# EAGLE design es9023 (EAGLE 6.1)
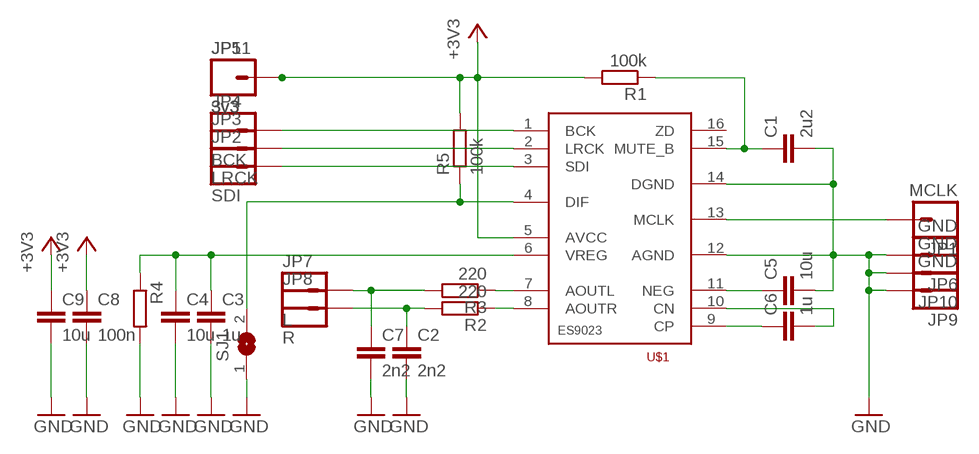
[diagram p0: schematic, sheet 1]

## Parts
C1  2u2  C-EUC0805K  [C0805K]
C2  2n2  C-EUC0805K  [C0805K]
C3  1u  C-EUC0805K  [C0805K]
C4  10u  C-EUC0805K  [C0805K]
C5  10u  C-EUC0805K  [C0805K]
C6  1u  C-EUC0805K  [C0805K]
C7  2n2  C-EUC0805K  [C0805K]
C8  100n  C-EUC0805K  [C0805K]
C9  10u  C-EUC0805K  [C0805K]
JP1  MCLK  M01PTH_LONGPAD  [1X01_LONGPAD]
JP2  SDI  M01PTH_LONGPAD  [1X01_LONGPAD]
JP3  LRCK  M01PTH_LONGPAD  [1X01_LONGPAD]
JP4  BCK  M01PTH_LONGPAD  [1X01_LONGPAD]
JP5  3v3  M01PTH_LONGPAD  [1X01_LONGPAD]
JP6  GND  M01PTH_LONGPAD  [1X01_LONGPAD]
JP7  L  M01PTH_LONGPAD  [1X01_LONGPAD]
JP8  R  M01PTH_LONGPAD  [1X01_LONGPAD]
JP9  GND  M01PTH_LONGPAD  [1X01_LONGPAD]
JP10  GND  M01PTH_LONGPAD  [1X01_LONGPAD]
JP11  3v3  M01PTH_LONGPAD  [1X01_LONGPAD]
R1  100k  R-EU_M0805  [M0805]
R2  220  R-EU_M0805  [M0805]
R3  220  R-EU_M0805  [M0805]
R4  R-EU_M0805  [M0805]
R5  100k  R-EU_M0805  [M0805]
SJ1  SJ  [SJ]
U$1  ES9023-SMD  [SOP16]

## Nets
+3V3: C8.1 C9.1 JP5.1 JP11.1 R1.2 R5.2 U$1.5(AVCC)
GND: C1.2 C2.2 C3.2 C4.2 C5.2 C7.2 C8.2 C9.2 JP6.1 JP9.1 JP10.1 R4.2 SJ1.1 U$1.12(AGND) U$1.14(DGND)
N$1: C1.1 R1.1 U$1.15(MUTE_B)
N$2: C3.1 C4.1 R4.1 U$1.6(VREG)
N$3: C5.1 U$1.11(NEG)
N$4: C6.2 U$1.10(CN)
N$5: C6.1 U$1.9(CP)
N$6: R3.1 U$1.7(AOUTL)
N$7: R2.1 U$1.8(AOUTR)
N$8: JP4.1 U$1.1(BCK)
N$9: JP3.1 U$1.2(LRCK)
N$10: JP2.1 U$1.3(SDI)
N$11: C7.1 JP7.1 R3.2
N$12: C2.1 JP8.1 R2.2
N$13: JP1.1 U$1.13(MCLK)
N$14: R5.1 SJ1.2 U$1.4(DIF)
Unconnected: U$1.16(ZD)

## Library data of the parts
C1-C9 = rcl:C-EU: CAPACITOR, European symbol
JP1-JP11 = _MY_OWN_LIB:M01: Header 1 Standard 1-pin 0.1" header. Use with straight break away headers (SKU : PRT-00116), right angle break away headers (PRT-00553), swiss pins (PRT-00743), machine pins (PRT-00117), and female headers (PRT-00115).
R1-R5 = rcl:R-EU_: RESISTOR, European symbol
SJ1 = jumper:SJ: SMD solder JUMPER
U$1 = _MY_OWN_LIB:ES9023

## Board
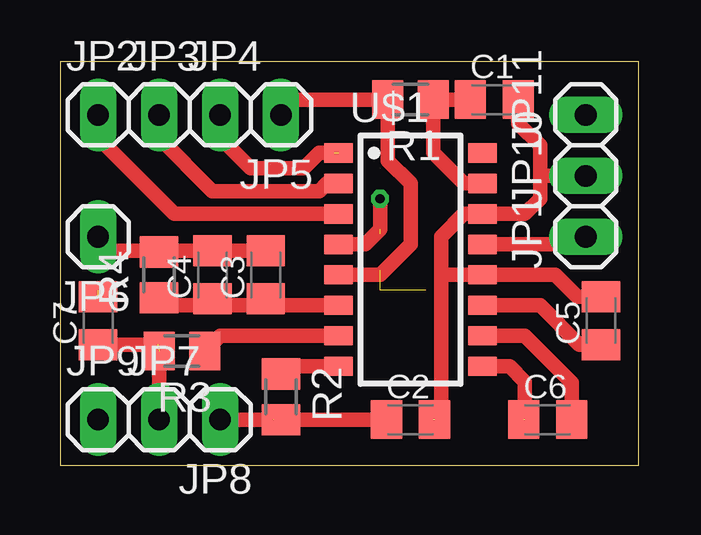
[diagram p1: board, top side]
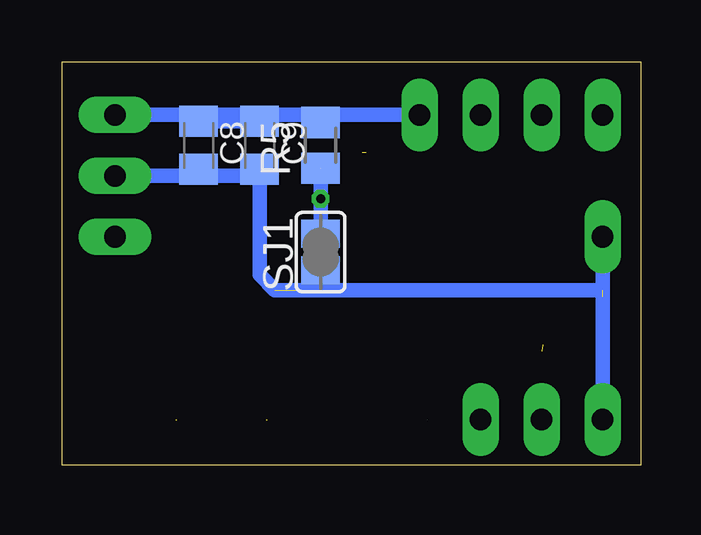
[diagram p2: board, bottom side, seen from below]

Size 24.11 x 16.82 mm. Coordinates in mm from the lower left corner, seen from the top.
Outline: 0,0 24.11,0 24.11,16.82 0,16.82 0,0
Copper layers (1*16): Top 0.0356mm / dielectric 1.5011mm / Bottom 0.0356mm
Design rules: minimum track width 6mil, minimum drill 13mil, track to track 6mil, track to pad 6mil, pad to pad 6mil, via to via 6mil, smd to smd 6mil, copper to edge 15mil, drill to drill 6mil, minimum pad ring 7mil, minimum via ring 7mil, stop-mask expansion 3mil, vias tented up to drill 0mil, thermal gap 10mil

### Footprints (pad centres in the part's own frame; a part is rotated, then mirrored left to right if it is on the bottom)
C0805K = smd 1.3 x 1.6: 1 -1,0; 2 1,0
1X01_LONGPAD = drill 0.9 pad 1.524 long: 1 0,0
M0805 = smd 1.3 x 1.6: 1 -0.95,0; 2 0.95,0
SJ = smd 1.168 x 1.6: 1 -0.762,0; 2 0.762,0
SOP16 = smd 0.8 x 1.2: 1 -4.445,-3; 2 -3.175,-3; 3 -1.905,-3; 4 -0.635,-3; 5 0.635,-3; 6 1.905,-3; 7 3.175,-3; 8 4.445,-3; 9 4.445,3; 10 3.175,3; 11 1.905,3; 12 0.635,3; 13 -0.635,3; 14 -1.905,3; 15 -3.175,3; 16 -4.445,3

### Placement (x,y rotation side)
C1  18.1,15.24 0 top
C2  14.61,1.91 0 top
C3  8.57,7.94 90 top
C4  6.35,7.94 90 top
C5  22.54,6.03 90 top
C6  20.32,1.91 0 top
C7  1.59,6.03 90 top
C8  18.41,13.34 270 bottom
C9  15.88,13.34 270 bottom
JP1  21.91,9.53 90 top
JP2  1.59,14.61 0 top
JP3  4.13,14.61 0 top
JP4  6.67,14.61 0 top
JP5  9.21,14.61 180 top
JP6  1.59,9.53 180 top
JP7  4.13,1.91 0 top
JP8  6.67,1.91 180 top
JP9  1.59,1.91 0 top
JP10  21.91,12.06 90 top
JP11  21.91,14.61 90 top
R1  14.61,15.24 180 top
R2  9.21,2.86 270 top
R3  5.08,4.76 180 top
R4  4.13,7.94 90 top
R5  13.34,13.34 90 bottom
SJ1  13.34,8.89 90 bottom
U$1  14.61,8.57 270 top

### Tracks (layer width: path | path; a pad name or v marks a point on that pad's centre or on a via)
+3V3
  Top 0.61: U$1.5 13.34,7.94 14.61,9.21 14.61,11.75 13.65,12.7 R1.2 9.84,15.24 JP5.1
  Bottom 0.61: JP11.1 15.88,14.61 | 15.88,14.61 13.34,14.61 | 13.34,14.61 JP5.1 | 15.88,14.61 C9.1 C8.1 | R5.2 13.34,14.61
GND  (5 unrouted)
  Top 0.61: C5.2 21.54,7.03 20.64,7.94 U$1.12 15.88,7.94 | 15.56,1.95 C2.2 | 20,12.06 20,11.11 19.37,10.48 U$1.14 16.83,10.48 15.88,9.53 15.88,7.94 | 20,12.06 20,13.34 19.1,14.24 C1.2 | JP10.1 20,12.06 | 15.88,7.94 15.88,2.22 15.56,1.91 | C3.2 C4.2 4.13,8.94 | 4.13,8.94 R4.2 | 4.13,8.94 2.17,8.94 JP6.1
  Bottom 0.61: JP9.1 1.59,7.3 | 1.59,7.3 JP6.1 | JP10.1 18.41,12.06 | 18.41,12.06 15.88,12.06 | 15.88,12.06 15.88,7.94 15.24,7.3 1.59,7.3 | C8.2 18.41,12.06 | C9.2 15.88,12.06
N$1
  Top 0.61: C1.1 R1.1 15.56,13.02 16.83,11.75 U$1.15
N$2
  Top 0.61: U$1.6 8.89,6.68 | 8.89,6.68 4.13,6.68 R4.1 4.13,6.67 6.35,6.67 C4.1 | C3.1 8.89,6.94 8.89,6.68
N$3
  Top 0.61: C5.1 21.64,5.03 20,6.67 U$1.11
N$4
  Top 0.61: C6.2 21.32,3.44 19.37,5.4 U$1.10
N$5  (1 unrouted)
  Top 0.61: U$1.9 18.73,4.13 19.37,3.49 19.37,1.91
N$6
  Top 0.61: U$1.7 6.67,5.41 R3.1
N$7
  Top 0.61: U$1.8 9.54,4.14 R2.1
N$8  (1 unrouted)
  Top 0.61: JP4.1 6.67,13.65 7.94,12.38 10.16,12.38 10.79,13.02 11.43,13.02
N$9
  Top 0.61: JP3.1 4.13,13.65 6.35,11.43 10.79,11.43 11.11,11.75 U$1.2
N$10
  Top 0.61: JP2.1 1.59,13.65 4.75,10.49 11.6,10.49 U$1.3
N$11  (1 unrouted)
  Top 0.61: C7.1 4.08,5.03 4.13,5.08 JP7.1
N$12  (1 unrouted)
  Top 0.61: 8.89,1.91 R2.2 C2.1 | JP8.1 8.89,1.91
N$13
  Top 0.61: U$1.13 21.59,9.21 JP1.1
N$14  (via drill 0.38)  (2 unrouted)
  Top 0.61: U$1.4 12.71,9.22 13.34,9.84 v13.34,11.11
  Bottom 0.61: R5.1 v13.34,11.11 13.34,10.16